# Altium schematic sheet 1_AT_Link_ISO_Interface.SchDoc
size A4
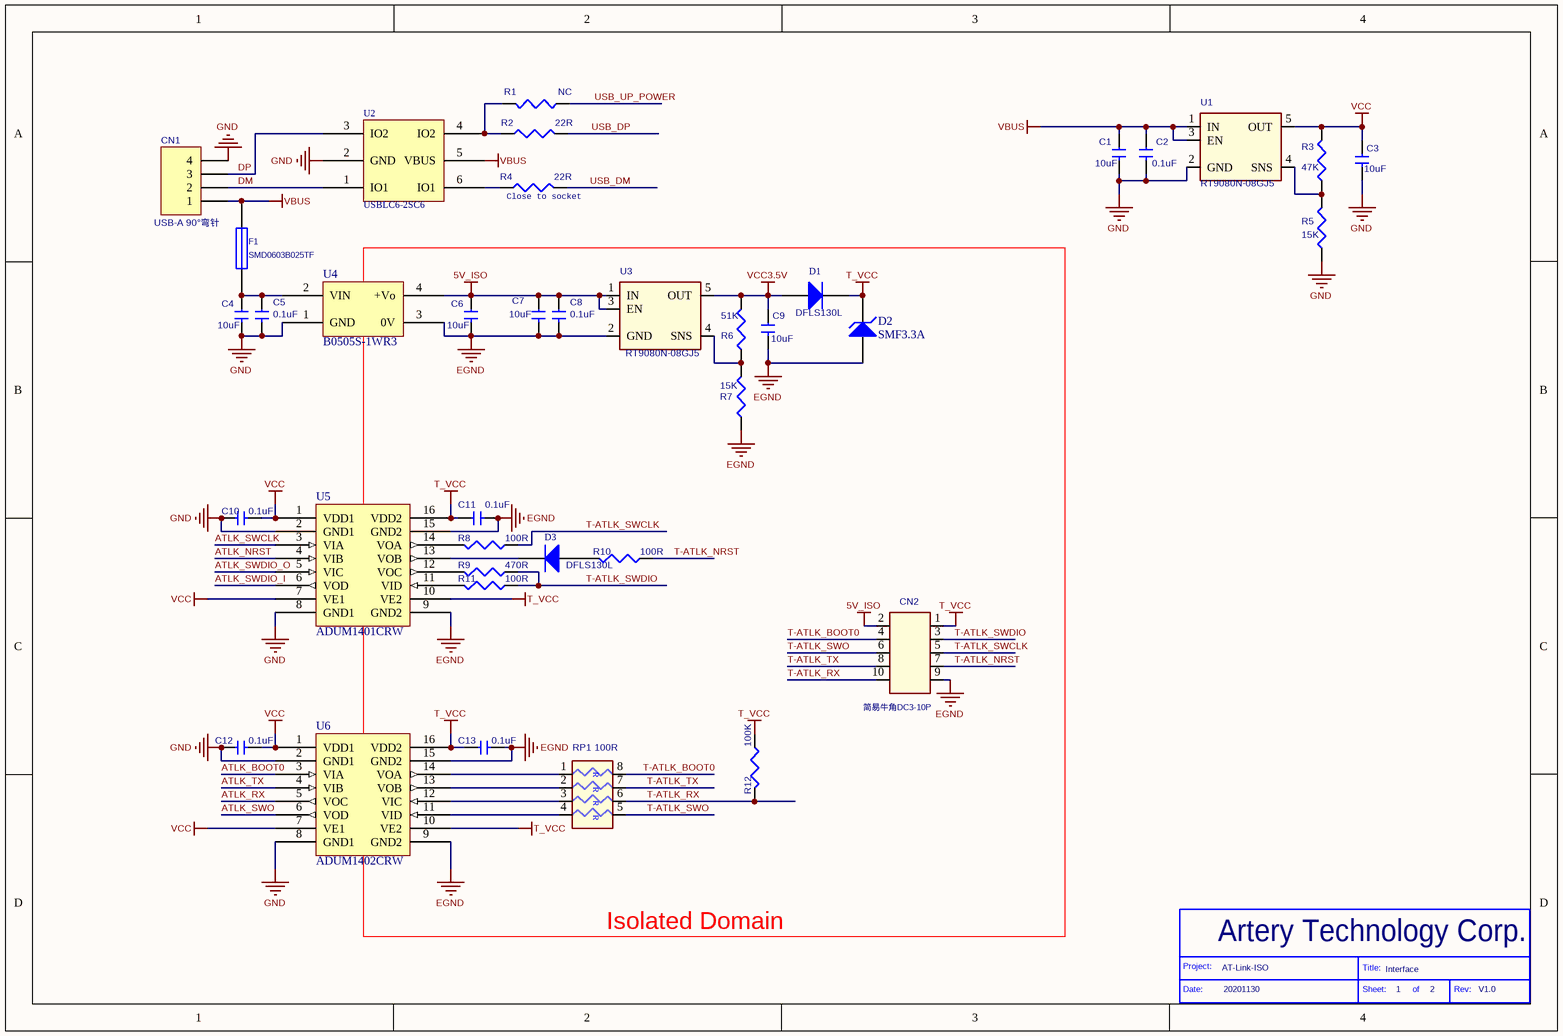
[diagram p0: 1_AT_Link_ISO_Interface.SchDoc]

## Parts
C1  10uF  [0603_c]
C2  0.1uF  [0603_c]
C3  10uF  [0603_c]
C4  10uF  [0603_c]
C5  0.1uF  [0603_c]
C6  10uF  [0603_c]
C7  10uF  [0603_c]
C8  0.1uF  [0603_c]
C9  10uF  [0603_c]
C10  0.1uF  [0603_c]
C11  0.1uF  [0603_c]
C12  0.1uF  [0603_c]
C13  0.1uF  [0603_c]
CN1  USB-A 90°弯针  [USB_A - Dip]
CN2  CON1  [SWD_2*5P_SMT]  (value not drawn)
D1  DFLS130L  [SOD-123]
D2  SMF3.3A  [SOD-123]
D3  DFLS130L  [SOD-123]
F1  SMD0603B025TF  [0603_r]
R1  NC  [0603_r]
R2  22R  [0603_r]
R3  47K  [0603_r]
R4  22R  [0603_r]
R5  15K  [0603_r]
R6  51K  [0603_r]
R7  15K  [0603_r]
R8  100R  [0603_r]
R9  470R  [0603_r]
R10  100R  [0603_r]
R11  100R  [0603_r]
R12  100K  [0603_r]
RP1  100R  [0603*4,8P4R]
U1  RT9080N-08GJ5  [SOT-23-5]
U2  USBLC6-2SC6  [SOT-23-6]
U3  RT9080N-08GJ5  [SOT-23-5]
U4  B0505S-1WR3  [B0505S-1WR3-B]
U5  ADUM1401CRW  [SOIC-16_300mil]
U6  ADUM1402CRW  [SOIC-16_300mil]

## Blocks framed on the sheet
Isolated Domain: C6-C9 C11 C13 CN2 D1-D3 R6-R12 RP1 U3-U6

## Nets
5V_ISO: C6.1 C7.1 C8.1 CN2.2 U3.1(IN) U3.3(EN) U4.4(+Vo)
EGND: C6.2 C7.2 C8.2 C9.2 C11.2 C13.2 CN2.9 D2.1(A) R7.1 U3.2(GND) U4.3(0V) U5.9(GND2) U5.15(GND2) U6.9(GND2) U6.15(GND2)
GND: C1.2 C2.2 C3.2 C4.2 C5.2 C10.1 C12.1 CN1.4 R5.1 U1.2(GND) U2.2(GND) U4.1(GND) U5.2(GND1) U5.8(GND1) U6.2(GND1) U6.8(GND1)
T_VCC: C11.1 C13.1 CN2.1 D1.2(K) D2.2(K) R12.1 U5.10(VE2) U5.16(VDD2) U6.10(VE2) U6.16(VDD2)
VBUS: C1.1 C2.1 CN1.1 F1.2 U1.1(IN) U1.3(EN) U2.5(VBUS)
VCC: C3.1 C10.2 C12.2 R3.2 U1.5(OUT) U5.1(VDD1) U5.7(VE1) U6.1(VDD1) U6.7(VE1)
VCC3.5V: C9.1 D1.1(A) R6.2 U3.5(OUT)
ATLK_BOOT0: U6.3(VIA)
ATLK_NRST: U5.4(VIB)
ATLK_RX: U6.5(VOC)
ATLK_SWCLK: U5.3(VIA)
ATLK_SWDIO_I: U5.6(VOD)
ATLK_SWDIO_O: U5.5(VIC)
ATLK_SWO: U6.6(VOD)
ATLK_TX: U6.4(VIB)
DM: CN1.2 U2.1(IO1)
DP: CN1.3 U2.3(IO2)
T-ATLK_BOOT0: CN2.4 RP1.8
T-ATLK_NRST: CN2.7 R10.1
T-ATLK_RX: CN2.10 R12.2 RP1.6
T-ATLK_SWCLK: CN2.5 R8.1
T-ATLK_SWDIO: CN2.3 R9.1 R11.1
T-ATLK_SWO: CN2.6 RP1.5
T-ATLK_TX: CN2.8 RP1.7
USB_DM: R4.2
USB_DP: R2.2
USB_UP_POWER: R1.1
NetC4_1: C4.1 C5.1 F1.1 U4.2(VIN)
NetD3_1: D3.1(A) R10.2
NetD3_2: D3.2(K) U5.13(VOB)
NetR1_2: R1.2 R2.1 U2.4(IO2)
NetR3_1: R3.1 R5.2 U1.4(SNS)
NetR4_1: R4.1 U2.6(IO1)
NetR6_1: R6.1 R7.2 U3.4(SNS)
NetR8_2: R8.2 U5.14(VOA)
NetR9_2: R9.2 U5.12(VOC)
NetR11_2: R11.2 U5.11(VID)
NetRP1_1: RP1.1 U6.14(VOA)
NetRP1_2: RP1.2 U6.13(VOB)
NetRP1_3: RP1.3 U6.12(VIC)
NetRP1_4: RP1.4 U6.11(VID)

## Notes on the sheet
- (near R4) Close to socket
- (near CN2) 简易牛角DC3-10P
- AT-Link-ISO
- 20201130
- Interface
- 1
- 2
- V1.0
- Project:
- Date:
- Artery Technology Corp.
- Title:
- Sheet:
- of
- Rev:
- (in symbol 22,1/16W,5%,8P4R) R

## Library data of the parts
C1 C3 C4 C6 C7 C9 = 0.1uF,50V,20%,SMD0603: 贴片陶瓷电容 10uF,16V,10%,X7R,SMD0603
C2 C5 C8 C10-C13 = 0.1uF,50V,20%,SMD0603: 贴片陶瓷电容 0.1uF,16V,10%,X7R,SMD0603
CN1 = Header 4: USB-A公头 /90°脚/直插式; LatestRevisionDate: 17-Jul-2002; LatestRevisionNote: Re-released for DXP Platform.; Publisher: Altium Limited
CN2 = CON10A_0: 简易牛角DC3-10P 直针 2.54mm 2*5P双排 黑色
D1 D3 = Diode: 贴片二极管 DFLS130L-7; Published: 8-Jun-2000; LatestRevisionDate: 17-Jul-2002; LatestRevisionNote: Re-released for DXP Platform.; PackageVersion: Sep-1996; PackageReference: SMC; Publisher: Altium Limited; PackageDescription: DO-214-AB/SMC; 2 C-Bend Leads; Body 7.9 x 5.9 mm, inc. leads (LxW); Code_JEDEC: DO-214-AB
D2 = SMF3.3A: TVS管SMF3.3A
F1 = Fuse 1: SMD0603B025TF 可恢复保险丝; Published: 8-Jun-2000; LatestRevisionDate: 17-Jul-2002; LatestRevisionNote: Re-released for DXP Platform.; PackageReference: PIN-W2/E2.8; Publisher: Altium Limited; PackageDescription: Thru-Hole; 2 Leads
R1 = 10K,1/10W,1%,SMD0603_Dup1
R2 R4 = 22,1/10W,1%,SMD0603: 贴片电阻 22R 5% 1/10W 0603
R3 = 470,1/10W,1%,SMD0603: 贴片电阻 47K 1% 1/10W 0603
R5 R7 = 470,1/10W,1%,SMD0603: 贴片电阻 15K 1% 1/10W 0603
R6 = 470,1/10W,1%,SMD0603: 贴片电阻 51K 1% 1/10W 0603
R8 R10 R11 = 22,1/10W,1%,SMD0603: 贴片电阻 100R 5% 1/10W 0603
R9 = 22,1/10W,1%,SMD0603: 贴片电阻 470R 5% 1/10W 0603
R12 = 22,1/10W,1%,SMD0603: 贴片电阻 100K 5% 1/10W 0603
RP1 = 22,1/16W,5%,8P4R: 贴片排阻 100R 5% 1/16W 0603
U1 U3 = RT9080N